# EAGLE design LPC_2TE_3.2 (EAGLE 4.16)
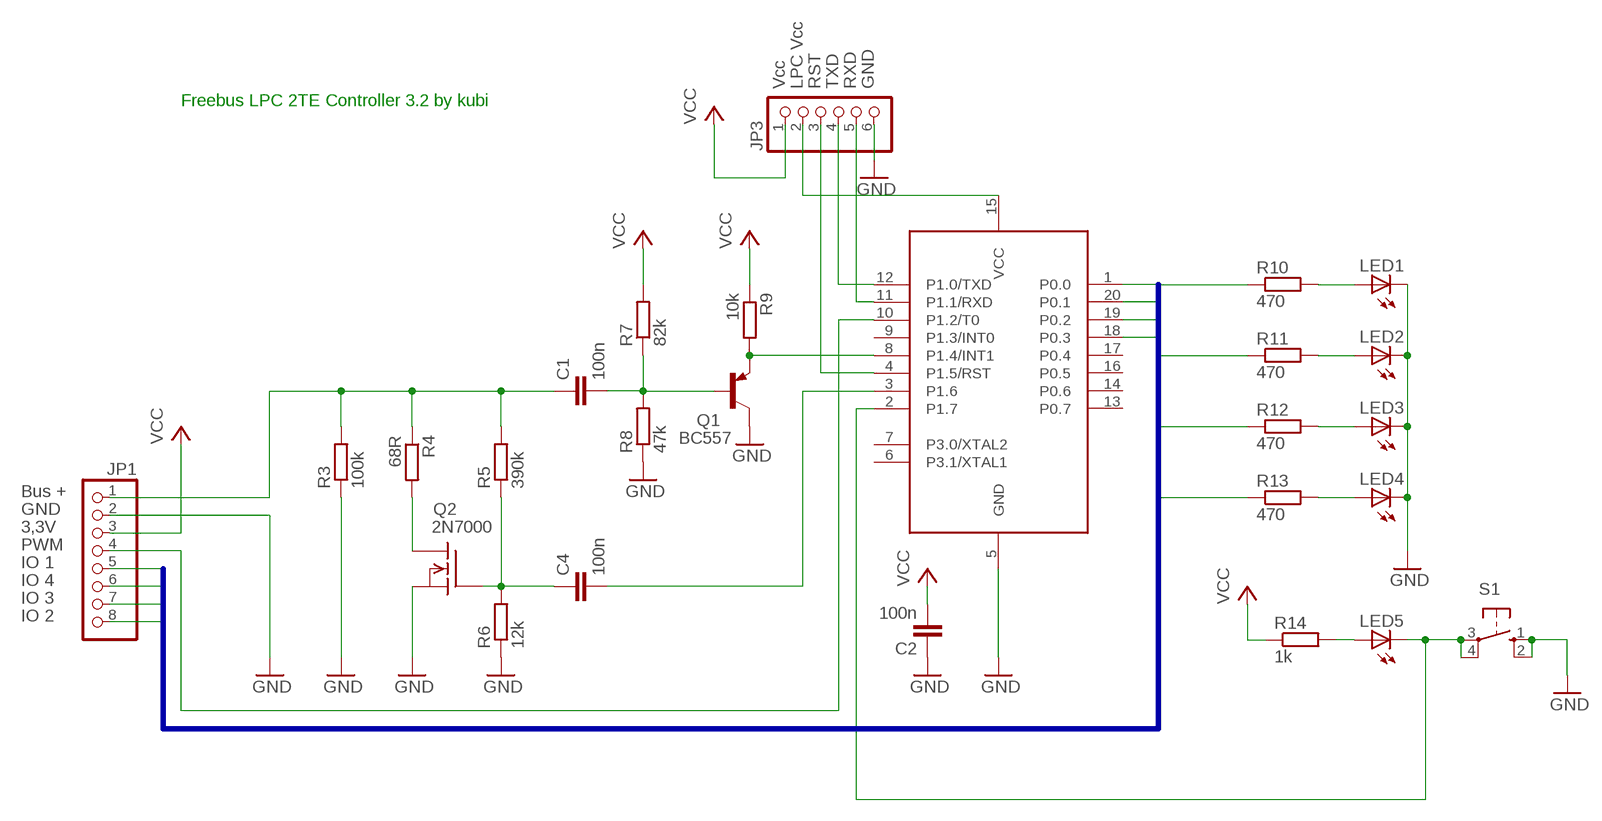
[diagram p0: schematic, sheet 1]

## Parts
C1  100n  C-EU050-024X044  [C050-024X044]
C2  100n  C-EU050-024X044  [C050-024X044]
C4  100n  C-EU050-024X044  [C050-024X044]
JP1  PINHD-1X8  [1X08]
JP3  PINHD-1X6  [1X06]
LED1  LED3MM  [LED3MM]
LED2  LED3MM  [LED3MM]
LED3  LED3MM  [LED3MM]
LED4  LED3MM  [LED3MM]
LED5  LED3MM  [LED3MM]
Q1  BC557  [TO92]
Q2  2N7000  VN2222KM  [TO237]
R3  100k  R-EU_0207/2V  [0207/2V]
R4  68R  R-EU_0207/2V  [0207/2V]
R5  390k  R-EU_0207/2V  [0207/2V]
R6  12k  R-EU_0207/2V  [0207/2V]
R7  82k  R-EU_0207/2V  [0207/2V]
R8  47k  R-EU_0207/2V  [0207/2V]
R9  10k  R-EU_0207/2V  [0207/2V]
R10  470  R-EU_0207/10  [0207/10]
R11  470  R-EU_0207/10  [0207/10]
R12  470  R-EU_0207/10  [0207/10]
R13  470  R-EU_0207/10  [0207/10]
R14  1k  R-EU_0207/10  [0207/10]
S1  10-XX  [B3F-10XX]
U1  89LPC922  [DIL20]

## Nets
GND: C2.1 JP1.2 JP3.6 LED1.K(C) LED2.K(C) LED3.K(C) LED4.K(C) Q1.3(C) Q2.3(S) R3.1 R6.1 R8.1 S1.1(S) S1.2(S1) U1.5(GND)
N$1: Q1.1(E) R9.2 U1.8(P1.4/INT1)
N$2: C1.2 Q1.2(B) R7.1 R8.2
N$3: JP1.4 U1.10(P1.2/T0)
N$4: C1.1 JP1.1 R3.2 R4.1 R5.2
N$5: C4.2 U1.3(P1.6)
N$6: Q2.1(D) R4.2
N$7: LED5.K(C) S1.3(P) S1.4(P1) U1.2(P1.7)
N$8: LED1.A R10.2
N$9: LED5.A R14.2
N$10: LED2.A R11.2
N$11: LED3.A R12.2
N$12: LED4.A R13.2
N$29: JP3.4 U1.12(P1.0/TXD)
N$30: JP3.5 U1.11(P1.1/RXD)
N$31: JP3.3 U1.4(P1.5/RST)
N$32: JP3.2 U1.15(VCC)
N$34: C4.1 Q2.2(G) R5.1 R6.2
P0.0: JP1.5 R10.1 U1.1(P0.0)
P0.1: JP1.8 R11.1 U1.20(P0.1)
P0.2: JP1.7 R12.1 U1.19(P0.2)
P0.3: JP1.6 R13.1 U1.18(P0.3)
VCC: C2.2 JP1.3 JP3.1 R7.2 R9.1 R14.1
Unconnected: U1.6(P3.1/XTAL1) U1.7(P3.0/XTAL2) U1.9(P1.3/INT0) U1.13(P0.7) U1.14(P0.6) U1.16(P0.5) U1.17(P0.4)

## Buses
P0.[0..3]

## Notes on the sheet
- Vcc | LPC Vcc | RST | TXD | RXD | GND
- Freebus LPC 2TE Controller 3.2 by kubi
- Bus +
- GND
- 3,3V
- PWM
- IO 1
- IO 4
- IO 3
- IO 2

## Library data of the parts
C1 C2 C4 = rcl:C-EU: CAPACITOR, European symbol
JP1 = pinhead:PINHD-1X8: PIN HEADER
JP3 = pinhead:PINHD-1X6: PIN HEADER
LED1-LED5 = led:LED: LED OSRAM: - CHIPLED LG R971, LG N971, LY N971, LG Q971, LY Q971, LO R971, LY R971 LH N974, LH R974 LS Q976, LO Q976, LY Q976 LO Q996 - Hyper CHIPLED LW Q18S LB Q993, LB Q99A, LB R99A - SideLED LS A670, LO A670, LY A670, LG A670, LP A670 LB A673, LV A673, LT A673, LW A673 LH A674 LY A675 LS A676, LA A676, LO A676, LY A676, LW A676 LS A679, LY A679, LG A679 - Hyper Micro SIDELED® LS Y876, LA Y876, LO Y876, LY Y876 LT Y87S - SmartLED LW L88C, LW L88S LB L89C, LB L89S, LG L890 LS L89K, LO L89K, LY L89K LS L896, LA L896, LO L896, LY L896 - TOPLED LS T670, LO T670, LY T670, LG T670, LP T670 LSG T670, LSP T670, LSY T670, LOP T670, LYG T670 LG T671, LOG T671, LSG T671 LB T673, LV T673, LT T673, LW T673 LH T674 LS T676, LA T676, LO T676, LY T676, LB T676, LH T676, LSB T676, LW T676 LB T67C, LV T67C, LT T67C, LS T67K, LO T67K, LY T67K, LW E67C LS E67B, LA E67B, LO E67B, LY E67B, LB E67C, LV E67C, LT E67C LW T67C LS T679, LY T679, LG T679 LS T770, LO T770, LY T770, LG T770, LP T770 LB T773, LV T773, LT T773, LW T773 LH T774 LS E675, LA E675, LY E675, LS T675 LS T776, LA T776, LO T776, LY T776, LB T776 LHGB T686 LT T68C, LB T68C - Hyper Mini TOPLED® LB M676 - Mini TOPLED Santana® LG M470 LS M47K, LO M47K, LY M47K Source: http://www.osram.convergy.de - LUMILED® LXK2-PW12-R00, LXK2-PW12-S00, LXK2-PW14-U00, LXK2-PW14-V00 LXK2-PM12-R00, LXK2-PM12-S00, LXK2-PM14-U00 LXK2-PE12-Q00, LXK2-PE12-R00, LXK2-PE12-S00, LXK2-PE14-T00, LXK2-PE14-U00 LXK2-PB12-K00, LXK2-PB12-L00, LXK2-PB12-M00, LXK2-PB14-N00, LXK2-PB14-P00, LXK2-PB14-Q00 LXK2-PR12-L00, LXK2-PR12-M00, LXK2-PR14-Q00, LXK2-PR14-R00 LXK2-PD12-Q00, LXK2-PD12-R00, LXK2-PD12-S00 LXK2-PH12-R00, LXK2-PH12-S00 LXK2-PL12-P00, LXK2-PL12-Q00, LXK2-PL12-R00 Source: www.luxeon.com
Q1 = transistor-pnp:BC557: PNP Transistor
Q2 = transistor-fet:VN2222KM: N-Channel Enhancement MOSFET (VMOS); 60V; 0,5A; 7,5Ohm
R3-R14 = rcl:R-EU_: RESISTOR, European symbol
S1 = switch-omron:10-XX: OMRON SWITCH
U1 = micro-philips:89LPC922

## Board
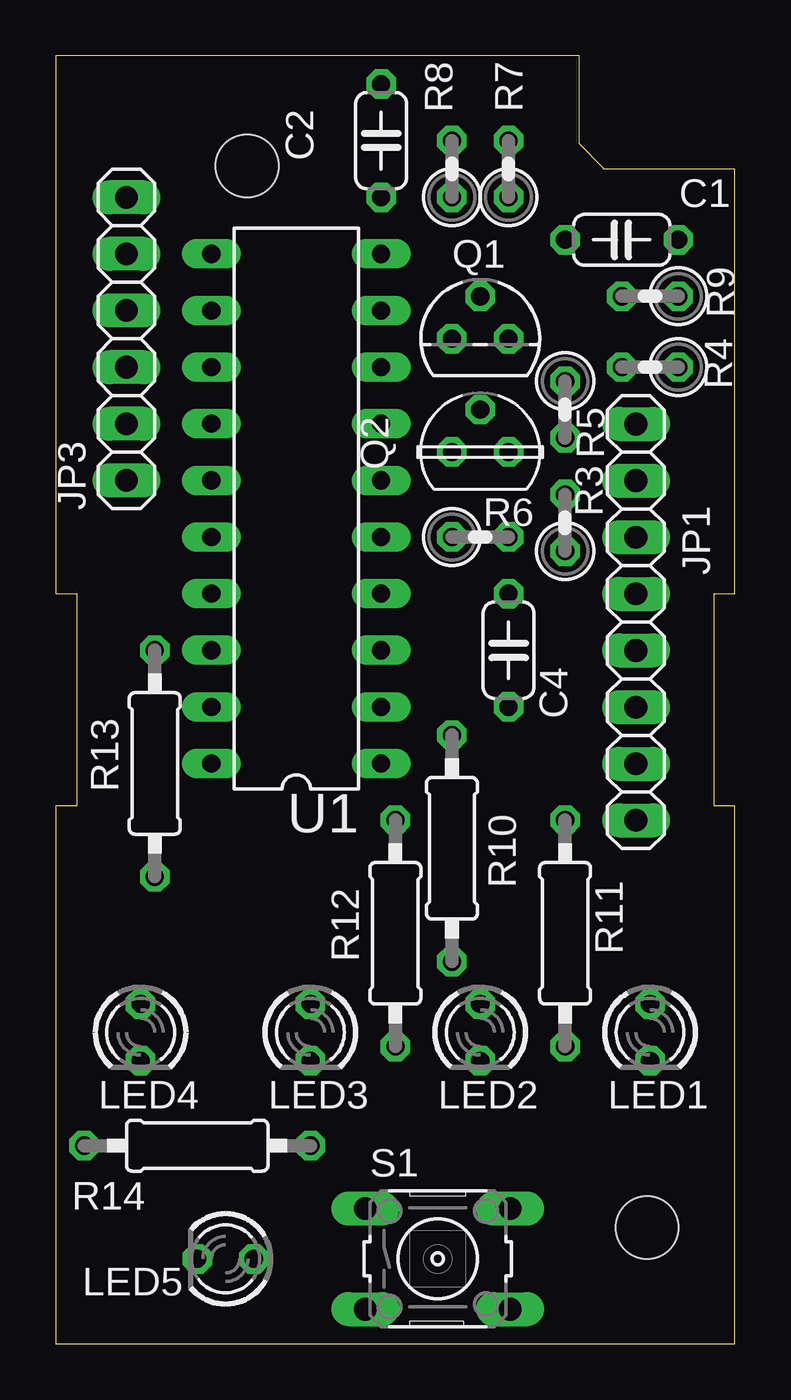
[diagram p1: board, top side]
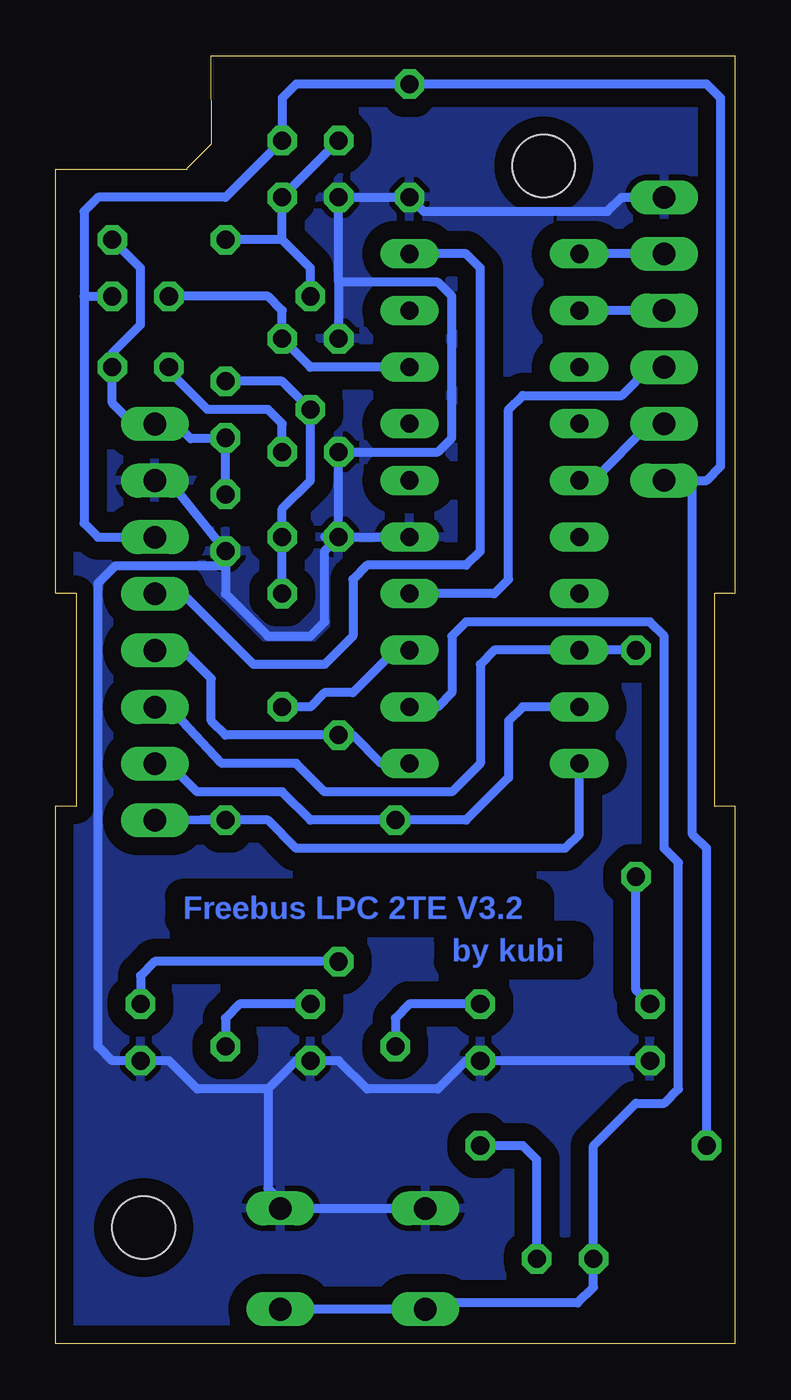
[diagram p2: board, bottom side, seen from below]

Size 30.48 x 57.78 mm. Coordinates in mm from the lower left corner, seen from the top.
Outline: 0,0 30.48,0 30.48,24.13 29.55,24.13 29.55,33.66 30.48,33.66 30.48,52.7 24.58,52.7 24.58,52.74 23.49,53.83 23.5,57.78 0,57.78 0,33.66 0.94,33.66 0.94,24.13 0,24.13 0,0
Copper layers (1*16): Top 0.035mm / dielectric 1.5mm / Bottom 0.035mm
Design rules "default": minimum track width 10mil, minimum drill 24mil, track to track 16mil, track to pad 12mil, pad to pad 16mil, via to via 16mil, smd to smd 8mil, copper to edge 20mil, drill to drill 8mil, minimum pad ring 10mil, minimum via ring 8mil, stop-mask expansion 4mil, vias tented up to drill 0mil, thermal gap 10mil
Holes 2.8 mm at 26.54,5.21 8.59,52.84

### Footprints (pad centres in the part's own frame; a part is rotated, then mirrored left to right if it is on the bottom)
C050-024X044 = drill 0.813 octagon: 1 -2.54,0; 2 2.54,0
1X08 = drill 1.016 long: 1 -8.89,0; 2 -6.35,0; 3 -3.81,0; 4 -1.27,0; 5 1.27,0; 6 3.81,0; 7 6.35,0; 8 8.89,0
1X06 = drill 1.016 long: 1 -6.35,0; 2 -3.81,0; 3 -1.27,0; 4 1.27,0; 5 3.81,0; 6 6.35,0
LED3MM = drill 0.813 octagon: A -1.27,0; K 1.27,0
TO92 = drill 0.813 octagon: 1 1.27,0; 2 0,1.905; 3 -1.27,0
TO237 = drill 0.813 octagon: 1 1.27,0; 2 0,1.905; 3 -1.27,0
0207/2V = drill 0.813 octagon: 1 -1.27,0; 2 1.27,0
0207/10 = drill 0.813 octagon: 1 -5.08,0; 2 5.08,0
B3F-10XX = drill 1.016 long: 1 -3.251,2.261; 2 3.251,2.261; 3 -3.251,-2.261; 4 3.251,-2.261
DIL20 = drill 0.813 long: 1 -11.43,-3.81; 2 -8.89,-3.81; 3 -6.35,-3.81; 4 -3.81,-3.81; 5 -1.27,-3.81; 6 1.27,-3.81; 7 3.81,-3.81; 8 6.35,-3.81; 9 8.89,-3.81; 10 11.43,-3.81; 11 11.43,3.81; 12 8.89,3.81; 13 6.35,3.81; 14 3.81,3.81; 15 1.27,3.81; 16 -1.27,3.81; 17 -3.81,3.81; 18 -6.35,3.81; 19 -8.89,3.81; 20 -11.43,3.81

### Placement (x,y rotation side)
C1  25.4,49.53 180 top
C2  14.61,53.98 90 top
C4  20.32,31.11 270 top
JP1  26.04,32.37 270 top
JP3  3.17,45.09 90 top
LED1  26.67,13.97 270 top
LED2  19.05,13.97 270 top
LED3  11.43,13.97 270 top
LED4  3.81,13.97 270 top
LED5  7.62,3.81 180 top
Q1  19.05,45.09 0 top
Q2  19.05,40.01 0 top
R3  22.86,36.83 90 top
R4  26.67,43.81 180 top
R5  22.86,41.91 270 top
R6  19.05,36.2 0 top
R7  20.32,52.7 90 top
R8  17.78,52.7 90 top
R9  26.67,46.99 180 top
R10  17.78,22.23 270 top
R11  22.86,18.41 270 top
R12  15.24,18.41 270 top
R13  4.45,26.04 270 top
R14  6.35,8.89 0 top
S1  17.14,3.81 0 top
U1  10.79,37.47 90 top

### Tracks (layer width: path | path; a pad name or v marks a point on that pad's centre or on a via)
GND
  Bottom 0.406: JP3.6 5.08,51.44 5.71,50.8 13.97,50.8 C2.1 R8.1 17.78,47.62 | R6.1 18.41,36.2 | JP1.2 25.4,38.72 R3.1 22.86,34.91 | R6.1 U1.5 | R6.1 Q2.3 13.34,40.01 12.7,40.64 12.7,46.99 13.34,47.62 17.78,47.62 | R6.1 18.41,35.56 18.41,32.38 19.05,31.75 20.95,31.75 22.86,33.66 22.86,34.91 | 20.95,11.43 19.68,12.7 LED2.K 17.78,12.7 16.51,11.43 13.34,11.43 12.06,12.7 LED3.K LED4.K | 20.95,11.43 20.95,6.99 20.32,6.35 | 20.32,6.35 20.4,6.27 S1.2 | S1.1 20.04,6.07 20.32,6.35 | 20.95,11.43 24.13,11.43 25.4,12.7 LED1.K 27.94,12.7 28.57,13.34 28.57,34.12 27.79,34.91 22.86,34.91 | 17.78,47.62 Q1.3
  pour Bottom (isolate 0.813): -0.62,58.5 30.49,58.5 31.27,57.72 31.27,-1.09 30.96,-1.4 -0.62,-1.4
N$1
  Bottom 0.406: U1.8 19.05,43.81 Q1.1 20.32,46.35 20.95,46.99 R9.2
N$2
  Bottom 0.406: R8.2 R7.1 20.32,49.53 | Q1.2 19.05,48.26 20.32,49.53 | 20.32,49.53 C1.2
N$3
  Bottom 0.406: U1.10 12.06,48.9 11.43,48.26 11.43,35.56 12.06,34.92 16.51,34.92 17.14,34.29 17.14,31.75 18.41,30.48 21.6,30.48 24.77,33.64 JP1.4
N$4
  Bottom 0.406: C1.1 26.67,48.26 26.67,45.72 27.94,44.45 R4.1 27.94,42.21 26.99,41.26 JP1.1 25.08,41.26 24.43,40.6 22.87,40.6 R5.2 R3.2
N$5
  Bottom 0.406: U1.3 15.24,31.11 17.14,29.21 18.41,29.21 19.05,28.57 C4.2
N$6
  Bottom 0.406: R4.2 25.4,43.65 23.66,41.91 20.95,41.91 20.32,41.27 Q2.1
N$7
  Bottom 0.406: U1.2 13.34,28.57 12.7,29.21 12.7,31.75 12.06,32.38 3.81,32.38 3.17,31.75 3.17,22.23 2.54,21.59 2.54,11.43 3.17,10.79 4.45,10.79 6.35,8.89 LED5.K 6.35,2.54 7.06,1.83 13.89,1.83 | 13.89,1.83 13.97,1.91 14.33,1.55 S1.4 | 13.89,1.83 S1.3
N$8
  Bottom 0.406: R10.2 26.04,17.14 26.67,16.51 LED1.A
N$9
  Bottom 0.406: LED5.A 8.89,8.26 9.53,8.89 R14.2
N$10
  Bottom 0.406: R11.2 22.86,14.61 22.23,15.24 LED2.A
N$11
  Bottom 0.406: R12.2 15.24,14.61 14.61,15.24 LED3.A
N$12
  Bottom 0.406: LED4.A 4.45,15.88 R13.2
N$29
  Bottom 0.406: JP3.4 U1.12
N$30
  Bottom 0.406: JP3.5 U1.11
N$31
  Bottom 0.406: U1.4 10.79,33.66 10.16,34.29 10.16,41.91 9.53,42.55 5.08,42.55 3.81,43.81 JP3.3
N$32
  Bottom 0.406: U1.15 6.35,38.73 3.81,41.27 JP3.2
N$34
  Bottom 0.406: R5.1 20.32,43.18 Q2.2 19.05,38.73 20.32,37.47 R6.2 C4.1
P0.0
  Bottom 0.406: U1.1 15.88,26.04 17.14,27.3 R10.1 22.86,27.3 23.5,27.94 23.5,29.84 24.75,31.1 JP1.5
P0.1
  Bottom 0.406: JP1.8 25.19,23.48 23.95,23.5 R11.1 20.95,23.5 19.68,22.23 7.62,22.23 6.99,22.86 U1.20
P0.2
  Bottom 0.406: JP1.7 25.39,26.02 24.13,24.77 20.32,24.77 19.05,23.5 R12.1 12.06,23.5 10.16,25.4 10.16,27.94 9.53,28.57 U1.19
P0.3
  Bottom 0.406: JP1.6 25.4,28.56 23.03,26.04 19.68,26.04 18.41,24.77 12.7,24.77 11.43,26.04 11.43,30.48 10.79,31.11 U1.18 R13.1
VCC
  Bottom 0.406: 1.91,38.73 1.27,38.73 0.64,39.37 0.64,55.88 1.27,56.52 C2.2 19.68,56.52 20.32,55.88 R7.2 22.86,51.44 28.57,51.44 29.21,50.8 29.21,46.99 | 1.91,38.73 JP3.1 | 29.21,46.99 29.21,36.82 28.57,36.18 JP1.3 | 29.21,46.99 R9.1 | R14.1 1.27,22.23 1.91,22.86 1.91,38.73

### Text on the board
Bottom: Freebus LPC 2TE V3.2 | by kubi